# Altium schematic sheet Sheet.schdoc
size 287 x 164 mm
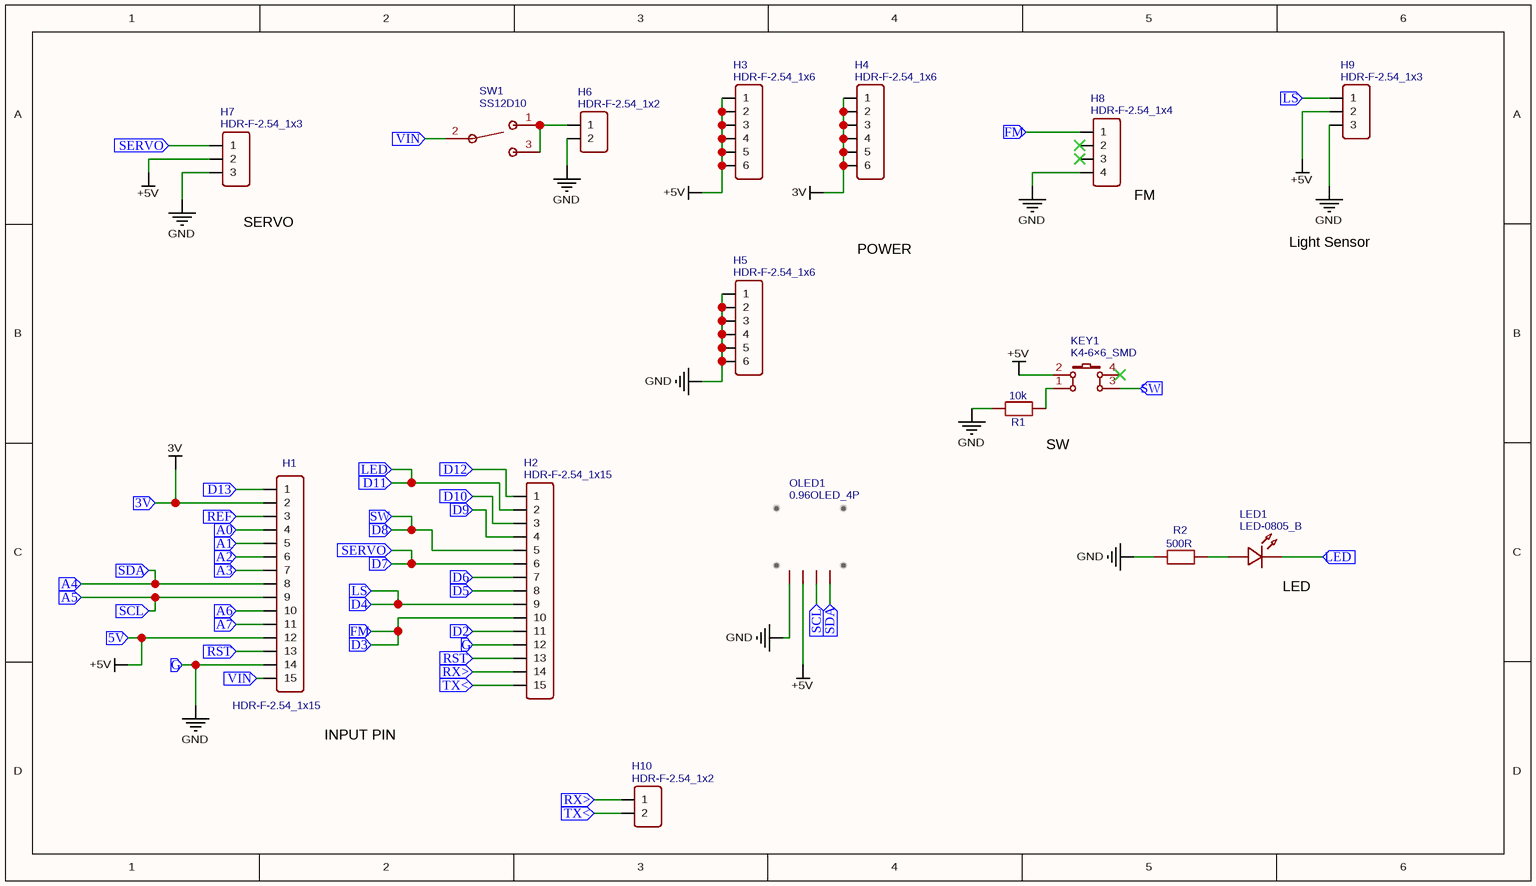
[diagram p0: Sheet.schdoc]

## Parts
H1  HDR-F-2.54_1x15  [HDR-F-2.54_1X15]
H2  HDR-F-2.54_1x15  [HDR-F-2.54_1X15]
H3  HDR-F-2.54_1x6  [HDR-F-2.54_1X6]
H4  HDR-F-2.54_1x6  [HDR-F-2.54_1X6]
H5  HDR-F-2.54_1x6  [HDR-F-2.54_1X6]
H6  HDR-F-2.54_1x2  [HDR-F-2.54_1X2]
H7  HDR-F-2.54_1x3  [HDR-F-2.54_1X3]
H8  HDR-F-2.54_1x4  [HDR-F-2.54_1X4]
H9  HDR-F-2.54_1x3  [HDR-F-2.54_1X3]
H10  HDR-F-2.54_1x2  [HDR-F-2.54_1X2]
KEY1  K4-6×6_SMD  [KEY-SMD_4P-L6.0-W6.0-P3.90-LS10.0]
LED1  LED-0805_B  [LED0805_BLUE]
OLED1  0.96OLED_4P  [0.96OLED_4P]
R1  10k  [R0805]
R2  500R  [R0805]
SW1  SS12D10  [SS12D10]

## Ports
3V (in), 5V (in), A0 (in), A1 (in), A2 (in), A3 (in), A4 (in), A5 (in), A6 (in), A7 (in), D2 (in), D3 (in), D4 (in), D5 (in), D6 (in), D7 (in), D8 (in), D9 (in), D10 (in), D11 (in), D12 (in), D13 (in), FM (in), G (in), LED (in), LS (in), REF (in), RST (in), RX> (in), SCL (in), SDA (in), SERVO (in), SW (in), TX< (in), VIN (in)

## Nets
3V: H1.2 H4.1 H4.2 H4.3 H4.4 H4.5 H4.6 ; port 3V
+5V: H1.12 H3.1 H3.2 H3.3 H3.4 H3.5 H3.6 H7.2 H9.2 KEY1.2 OLED1.2 ; port 5V
GND: H1.14 H2.12 H5.1 H5.2 H5.3 H5.4 H5.5 H5.6 H6.2 H7.3 H8.4 H9.3 OLED1.1 R1.1 R2.1 ; port G
A0: H1.4 ; port A0
A1: H1.5 ; port A1
A2: H1.6 ; port A2
A3: H1.7 ; port A3
A4: H1.8 OLED1.4 ; port A4, port SDA
A5: H1.9 OLED1.3 ; port A5, port SCL
A6: H1.10 ; port A6
A7: H1.11 ; port A7
D2: H2.11 ; port D2
D3: H2.10 H8.1 ; port D3, port FM
D4: H2.9 H9.1 ; port D4, port LS
D5: H2.8 ; port D5
D6: H2.7 ; port D6
D7: H2.6 H7.1 ; port D7, port SERVO
D8: H2.5 KEY1.3 ; port D8, port SW
D9: H2.4 ; port D9
D10: H2.3 ; port D10
D11: H2.2 LED1.2 ; port D11, port LED
D12: H2.1 ; port D12
D13: H1.1 ; port D13
REF: H1.3 ; port REF
RST: H1.13 H2.13 ; port RST
RX>: H2.14 H10.1 ; port RX>
TX<: H2.15 H10.2 ; port TX<
VIN: H1.15 SW1.2 ; port VIN
NetH6_1: H6.1 SW1.1 SW1.3
NetKEY1_1: KEY1.1 R1.2
NetLED1_1: LED1.1 R2.2

Not connected (* = marked no-connect by the designer): H8 2* 3*; KEY1 4*

## Notes on the sheet
- (near H7) SERVO
- (near H8) FM
- POWER
- Light Sensor
- SW
- (near LED1) LED
- INPUT PIN
- (in symbol 0.96OLED_4P) Hello World!!!

## Library data of the parts
H1 H2 = HDR-F-2.54_1x15: Contributor: LCEDA_Lib; BOM_Supplier Part: C124408; BOM_Supplier: LCSC; spicePre: H; spiceSymbolName: HDR-F-2.54_1x15
H3-H5 = HDR-F-2.54_1x6: Contributor: LCEDA_Lib; BOM_Supplier Part: C40877; BOM_Supplier: LCSC; spicePre: H; spiceSymbolName: HDR-F-2.54_1x6
H6 H10 = HDR-F-2.54_1x2: Contributor: LCEDA_Lib; BOM_Supplier Part: C49661; BOM_Supplier: LCSC; spicePre: H; spiceSymbolName: HDR-F-2.54_1x2
H7 H9 = HDR-F-2.54_1x3: Contributor: LCEDA_Lib; BOM_Supplier Part: C146690; BOM_Supplier: LCSC; spicePre: H; spiceSymbolName: HDR-F-2.54_1x3
H8 = HDR-F-2.54_1x4: Contributor: LCEDA_Lib; BOM_Supplier Part: C225501; BOM_Supplier: LCSC; spicePre: H; spiceSymbolName: HDR-F-2.54_1x4
KEY1 = K4-6×6_SMD: BOM_Manufacturer: 韩国韩荣; BOM_Manufacturer Part: K2-6639SP-D4SC-04; Contributor: LCEDA_Lib; BOM_Supplier Part: C191626; BOM_Supplier: LCSC; spicePre: K; spiceSymbolName: K4-6×6_SMD
LED1 = LED-0805_B: BOM_Manufacturer: 方舟 ARKLED; BOM_Manufacturer Part: D-B080508B1-KS2; Contributor: LCEDA_Lib; BOM_Supplier Part: C108412; spicePre: L; spiceSymbolName: LED-0805_B
OLED1 = 0.96OLED_4P: Contributor: LCEDA_Lib; BOM_Supplier: LCSC; spicePre: O; spiceSymbolName: 0.96OLED_4P
R1 = 10k: nameAlias: Value(Ω); Contributor: LCEDA_Lib; spicePre: R; spiceSymbolName: R_0805_EU
R2 = 500R: nameAlias: Value(Ω); Contributor: LCEDA_Lib; spicePre: R; spiceSymbolName: R_0805_EU
SW1 = SS12D10: BOM_Manufacturer: E-Switch; BOM_Manufacturer Part: EG1224; Contributor: LCSC; BOM_Supplier: LCSC; BOM_Supplier Part: C273395; spicePre: S; spiceSymbolName: SS12D10